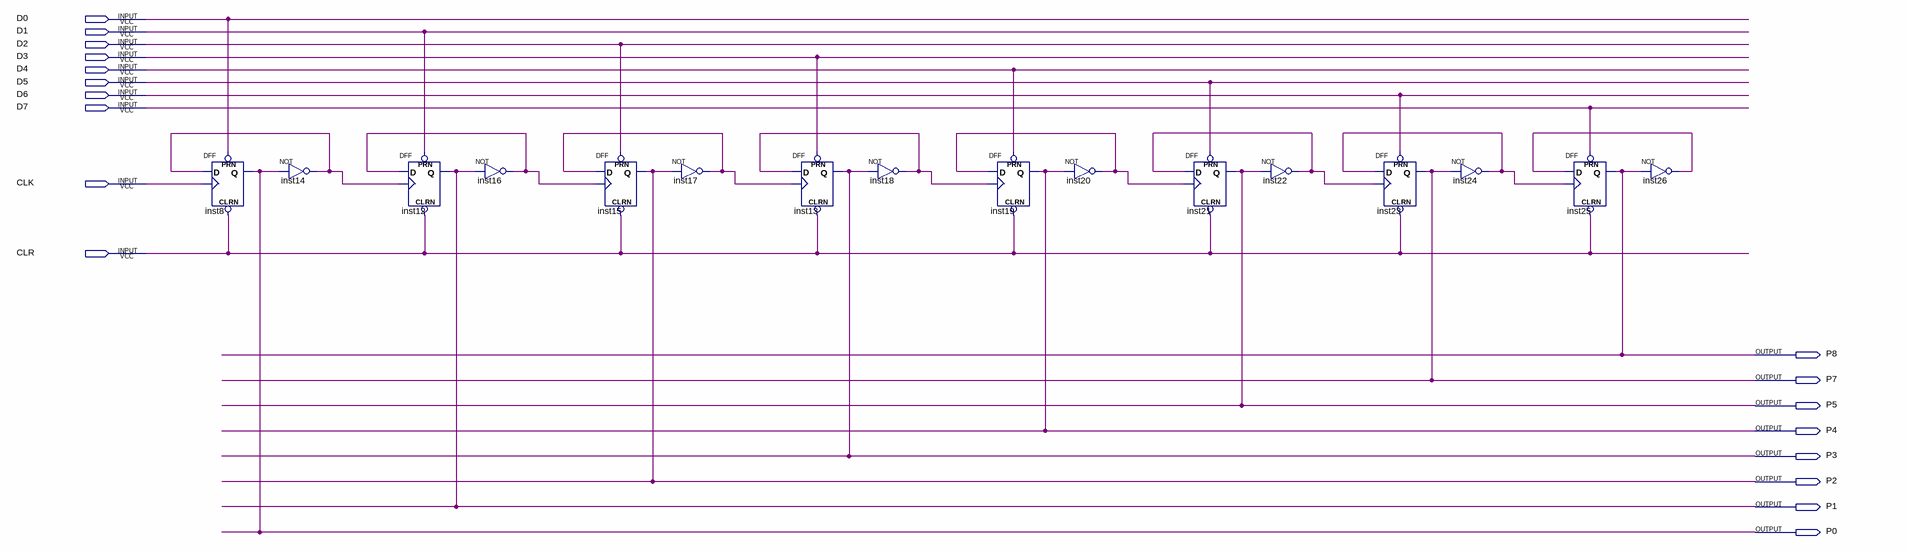
[diagram p0: schematic sheet]
// Quartus schematic Asynchronous-mode-256-Plus-1-counter.bdf as structural Verilog: 16 symbols, 18 pins
module \Asynchronous-mode-256-Plus-1-counter  (
  input  D0,
  input  D1,
  input  D2,
  input  D3,
  input  D4,
  input  D5,
  input  D6,
  input  D7,
  input  CLK,
  input  CLR,
  output P8,
  output P7,
  output P5,
  output P4,
  output P3,
  output P2,
  output P1,
  output P0
);

  wire inst14_out, inst16_out, inst17_out, inst18_out, inst20_out, inst22_out, inst24_out, inst26_out;

  DFF inst8 (.CLRN(CLR), .CLK(CLK), .D(inst14_out), .PRN(D0), .Q(P0));
  not inst14 (inst14_out, P0);
  DFF inst12 (.CLRN(CLR), .CLK(inst14_out), .D(inst16_out), .PRN(D1), .Q(P1));
  not inst16 (inst16_out, P1);
  DFF inst15 (.CLRN(CLR), .CLK(inst16_out), .D(inst17_out), .PRN(D2), .Q(P2));
  not inst17 (inst17_out, P2);
  DFF inst13 (.CLRN(CLR), .CLK(inst17_out), .D(inst18_out), .PRN(D3), .Q(P3));
  not inst18 (inst18_out, P3);
  DFF inst19 (.CLRN(CLR), .CLK(inst18_out), .D(inst20_out), .PRN(D4), .Q(P4));
  not inst20 (inst20_out, P4);
  DFF inst21 (.CLRN(CLR), .CLK(inst20_out), .D(inst22_out), .PRN(D5), .Q(P5));
  not inst22 (inst22_out, P5);
  DFF inst23 (.CLRN(CLR), .CLK(inst22_out), .D(inst24_out), .PRN(D6), .Q(P7));
  not inst24 (inst24_out, P7);
  DFF inst25 (.CLRN(CLR), .CLK(inst24_out), .D(inst26_out), .PRN(D7), .Q(P8));
  not inst26 (inst26_out, P8);
endmodule
